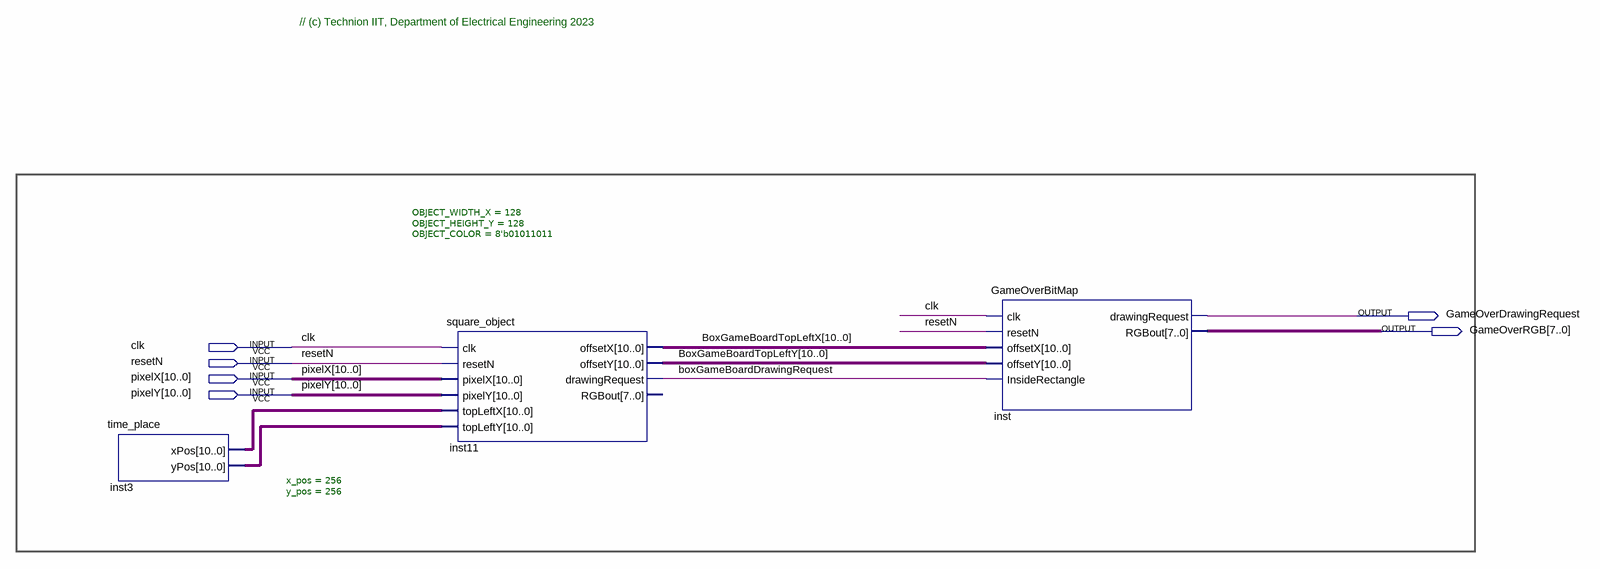
[diagram p0: schematic sheet]
// Quartus schematic ENDGAME_DISPLAY.bdf as structural Verilog: 3 symbols, 6 pins
module ENDGAME_DISPLAY (
  input  clk,
  input  resetN,
  input  [10:0] pixelX,
  input  [10:0] pixelY,
  output GameOverDrawingRequest,
  output [7:0] GameOverRGB
);

  wire boxGameBoardDrawingRequest;
  wire [10:0] BoxGameBoardTopLeftX, BoxGameBoardTopLeftY, inst3_xpos, inst3_ypos;

  time_place #(.x_pos(256), .y_pos(256)) inst3 (.xPos(inst3_xpos), .yPos(inst3_ypos));
  square_object #(.OBJECT_WIDTH_X(128), .OBJECT_HEIGHT_Y(128), .OBJECT_COLOR(8'b01011011)) inst11 (
    .clk(clk), .resetN(resetN), .pixelX(pixelX), .pixelY(pixelY), .topLeftX(inst3_xpos),
    .topLeftY(inst3_ypos), .offsetX(BoxGameBoardTopLeftX), .offsetY(BoxGameBoardTopLeftY),
    .drawingRequest(boxGameBoardDrawingRequest));  // open: RGBout
  GameOverBitMap inst (
    .clk(clk), .resetN(resetN), .offsetX(BoxGameBoardTopLeftX), .offsetY(BoxGameBoardTopLeftY),
    .InsideRectangle(boxGameBoardDrawingRequest), .drawingRequest(GameOverDrawingRequest),
    .RGBout(GameOverRGB));

  // Notes on the sheet:
  //   // (c) Technion IIT, Department of Electrical Engineering 2023
endmodule
